# EAGLE design Grove I2C FM Receiver v1.1 (EAGLE 6.4)
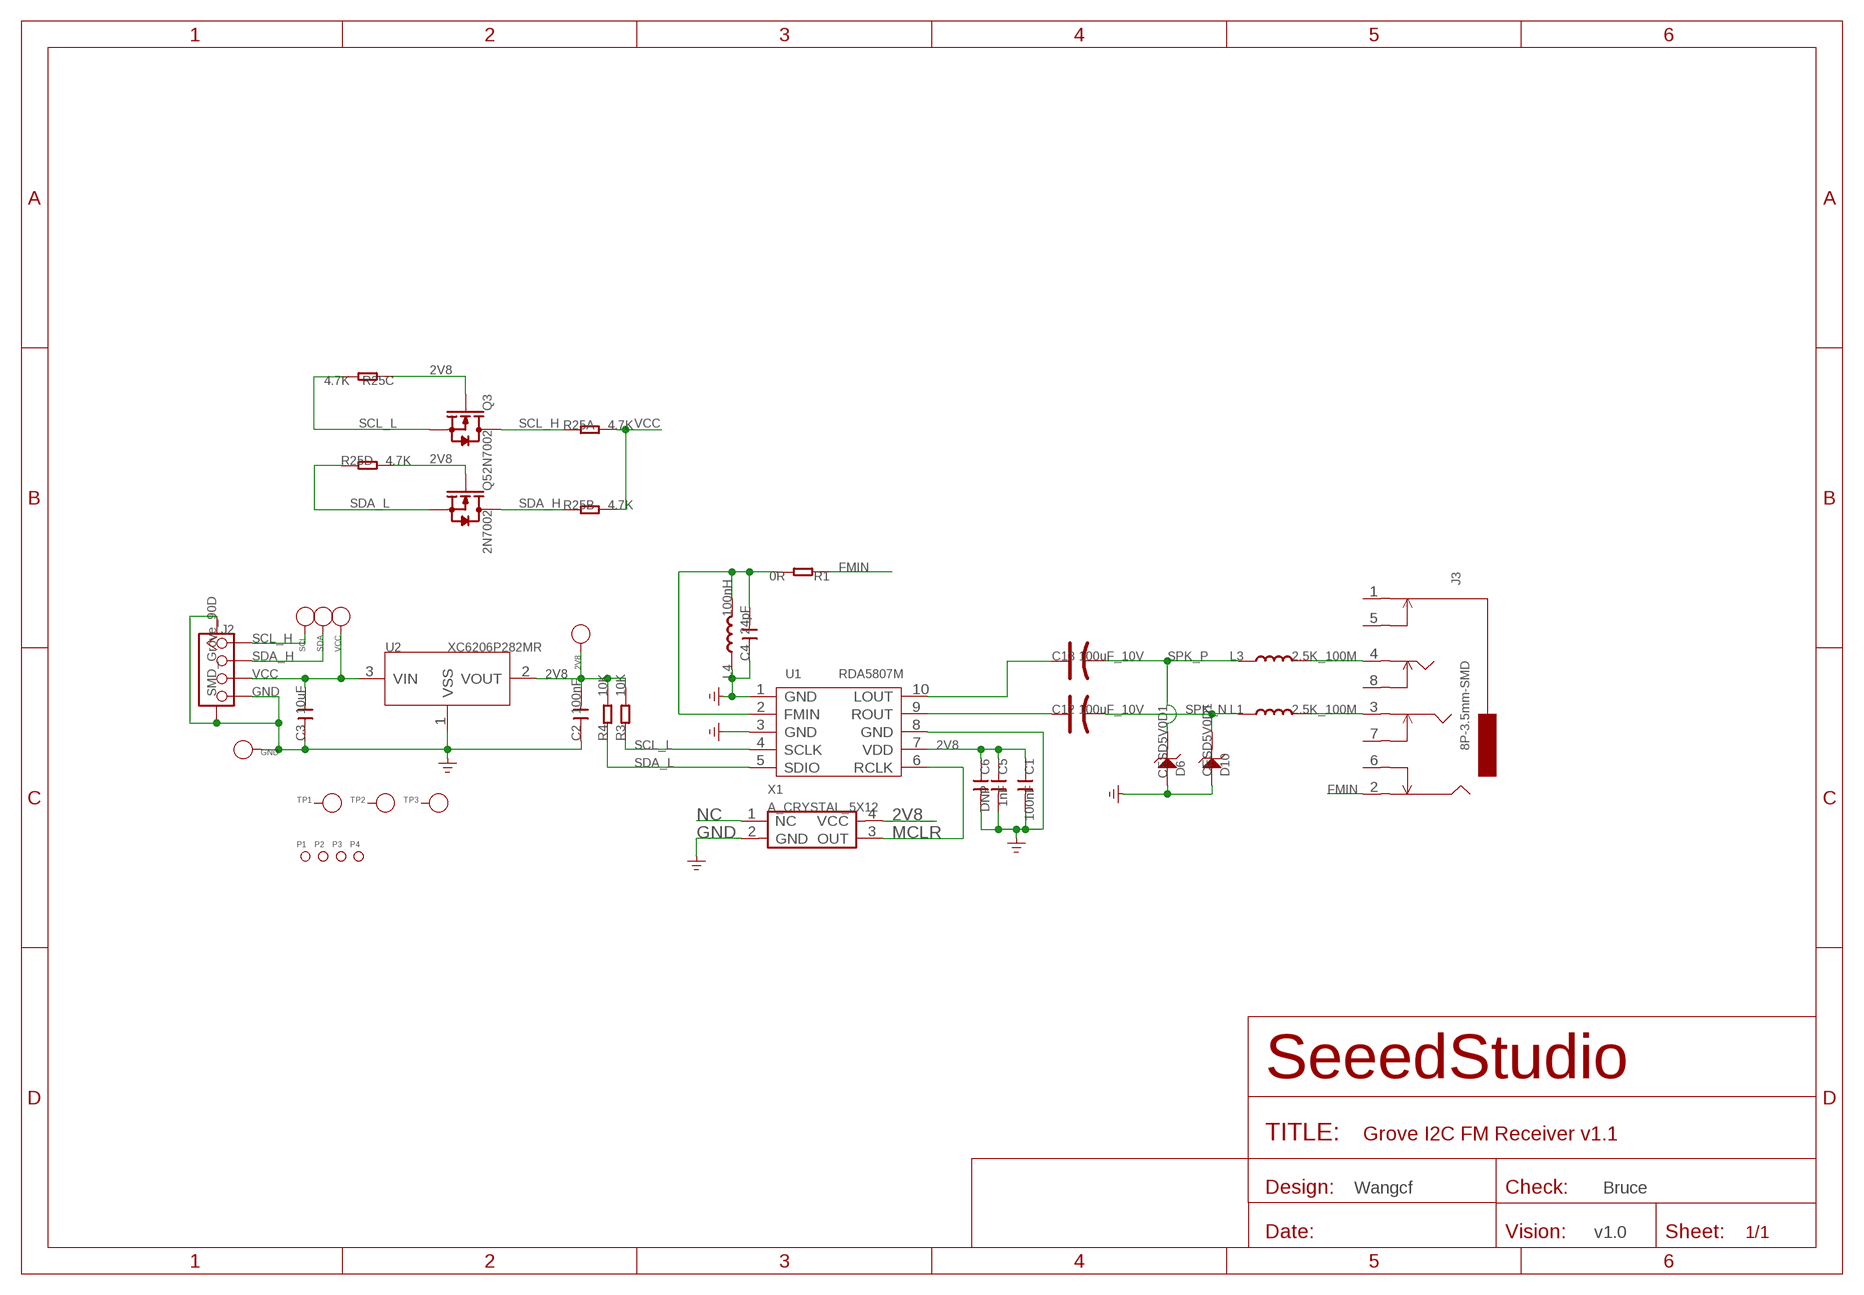
[diagram p0: schematic, sheet 1]

## Parts
2V8  PAD-TEST-POINT'4545'  [TP_4545]
C1  100nF  C-0603  [C0603]
C2  100nF  C-0603  [C0603]
C3  10uF  C-0805  [C0805]
C4  24pF  C-0603  [C0603]
C5  1nF  C-0603  [C0603]
C6  DNP  C-0603  [C0603]
C12  100uF_10V  CAP-AVX-B  [AVX-B]
C13  100uF_10V  CAP-AVX-B  [AVX-B]
D6  CESD5V0D1  D-ESD  [SOD123-2.7X1.6]
D10  CESD5V0D1  D-ESD  [SOD123-2.7X1.6]
GND  PAD-TEST-POINT'4545'  [TP_4545]
J2  SMD_Grove_90D  TWIG-4P-2.0-SMD-FEMALE-REINFORCE'DD'  [4P-SMD-2.0]
J3  8P-3.5mm-SMD  AUDIO-8P'PJ-3536-L6S'  [8P-3.5-SMD]
L1  2.5K_100M  L'0603'  [L0603]
L3  2.5K_100M  L'0603'  [L0603]
L4  100nH  L'0603'  [L0603]
P1  PAD-MARK'ANNULAR'  [ROUND-MARK-1.0]
P2  PAD-MARK'ANNULAR'  [ROUND-MARK-1.0]
P3  PAD-MARK'ANNULAR'  [ROUND-MARK-1.0]
P4  PAD-MARK'ANNULAR'  [ROUND-MARK-1.0]
Q3  2N7002  MOSFET-N'SOT23'  [SOT23]
Q5  2N7002  MOSFET-N'SOT23'  [SOT23]
R1  0R  R-0603  [R0603]
R3  10K  R-0603  [R0603]
R4  10K  R-0603  [R0603]
R25  4.7K  R-4R-1206  [1206-8-3.3X2.4]
SCL  PAD-TEST-POINT'4545'  [TP_4545]
SDA  PAD-TEST-POINT'4545'  [TP_4545]
TP1  PAD-TEST-POINT'4545'  [TP_4545]
TP2  PAD-TEST-POINT'4545'  [TP_4545]
TP3  PAD-TEST-POINT'4545'  [TP_4545]
U1  RDA5807M  [MSOP10]
U2  XC6206P282MR  XC6206MR  [SOT23]
VCC  PAD-TEST-POINT'4545'  [TP_4545]
X1  A_CRYSTAL_5X12  [4P_5X12]

## Nets
2V8: 2V8.T C1.1 C2.2 C5.1 C6.1 Q3.1(G) Q5.1(G) R3.2 R4.2 R25.3 R25.5 U1.7(VDD) U2.2(VOUT) X1.4(VCC)
FMIN: J3.2 R1.1
FMIN1: C4.2 L4.2 R1.2 U1.2(FMIN)
GND: C1.2 C2.1 C3.1 C4.1 C5.2 C6.2 D6.1 D10.1 GND.T J2.4 J2.SS1 J2.SS2 L4.1 U1.1(GND) U1.3(GND) U1.8(GND) U2.1(VSS) X1.2(GND)
MCLR: U1.6(RCLK) X1.3(OUT)
N$2: C12.+ U1.9(ROUT)
N$4: C13.+ U1.10(LOUT)
N$5: J3.4 L3.2
N$6: J3.3 L1.2
NC: X1.1(NC)
SCL_H: J2.1 Q3.3(D) R25.1 SCL.T
SCL_L: Q3.2(S) R3.1 R25.6 U1.4(SCLK)
SDA_H: J2.2 Q5.3(D) R25.2 SDA.T
SDA_L: Q5.2(S) R4.1 R25.4 U1.5(SDIO)
SPK_N: C12.- D10.2 L1.1
SPK_P: C13.- D6.2 L3.1
VCC: C3.2 J2.3 R25.7 R25.8 U2.3(VIN) VCC.T
Unconnected: J3.1 J3.5 J3.6 J3.7 J3.8 TP1.T TP2.T TP3.T

## Notes on the sheet
- Wangcf | Bruce
- v1.0

## Library data of the parts
2V8 GND SCL SDA TP1-TP3 VCC = Discrete:PAD-TEST-POINT; PARTNO: DNP
C1-C6 = Discrete:C*: Ceramic Capacitors
C12 C13 = Discrete:CAP*: Electrolytic Capacitors,Tantalum Capacitors and Super Capacitors
D6 D10 = template:D-ESD: Diodes for Protectiong against ESD
J2 = Connector :TWIG-4P-2.0-SMD-FEMALE-REINFORCE
J3 = template:AUDIO-8P
L1 L3 L4 = Discrete:L*
P1-P4 = Discrete:PAD-MARK; PARTNO: DNP
Q3 Q5 = Discrete:MOSFET-N: IRLL014: http://www.vishay.com/docs/91319/sihll014.pdf
R1 R3 R4 = Discrete:R*
R25 = Discrete:R-4R*: Resistor Array
U1 = template:RDA5807M: SINGLE-CHIP BROADCAST FM RADIO TUNER
U2 = IC:XC6206: LOW ESR Cap.Compatible Positive Voltage Regulators
X1 = CPT_SMD:A_CRYSTAL

## Net classes
0 default: width 0.152 mm, drill 0.305 mm, clearance 0.152 mm

## Board
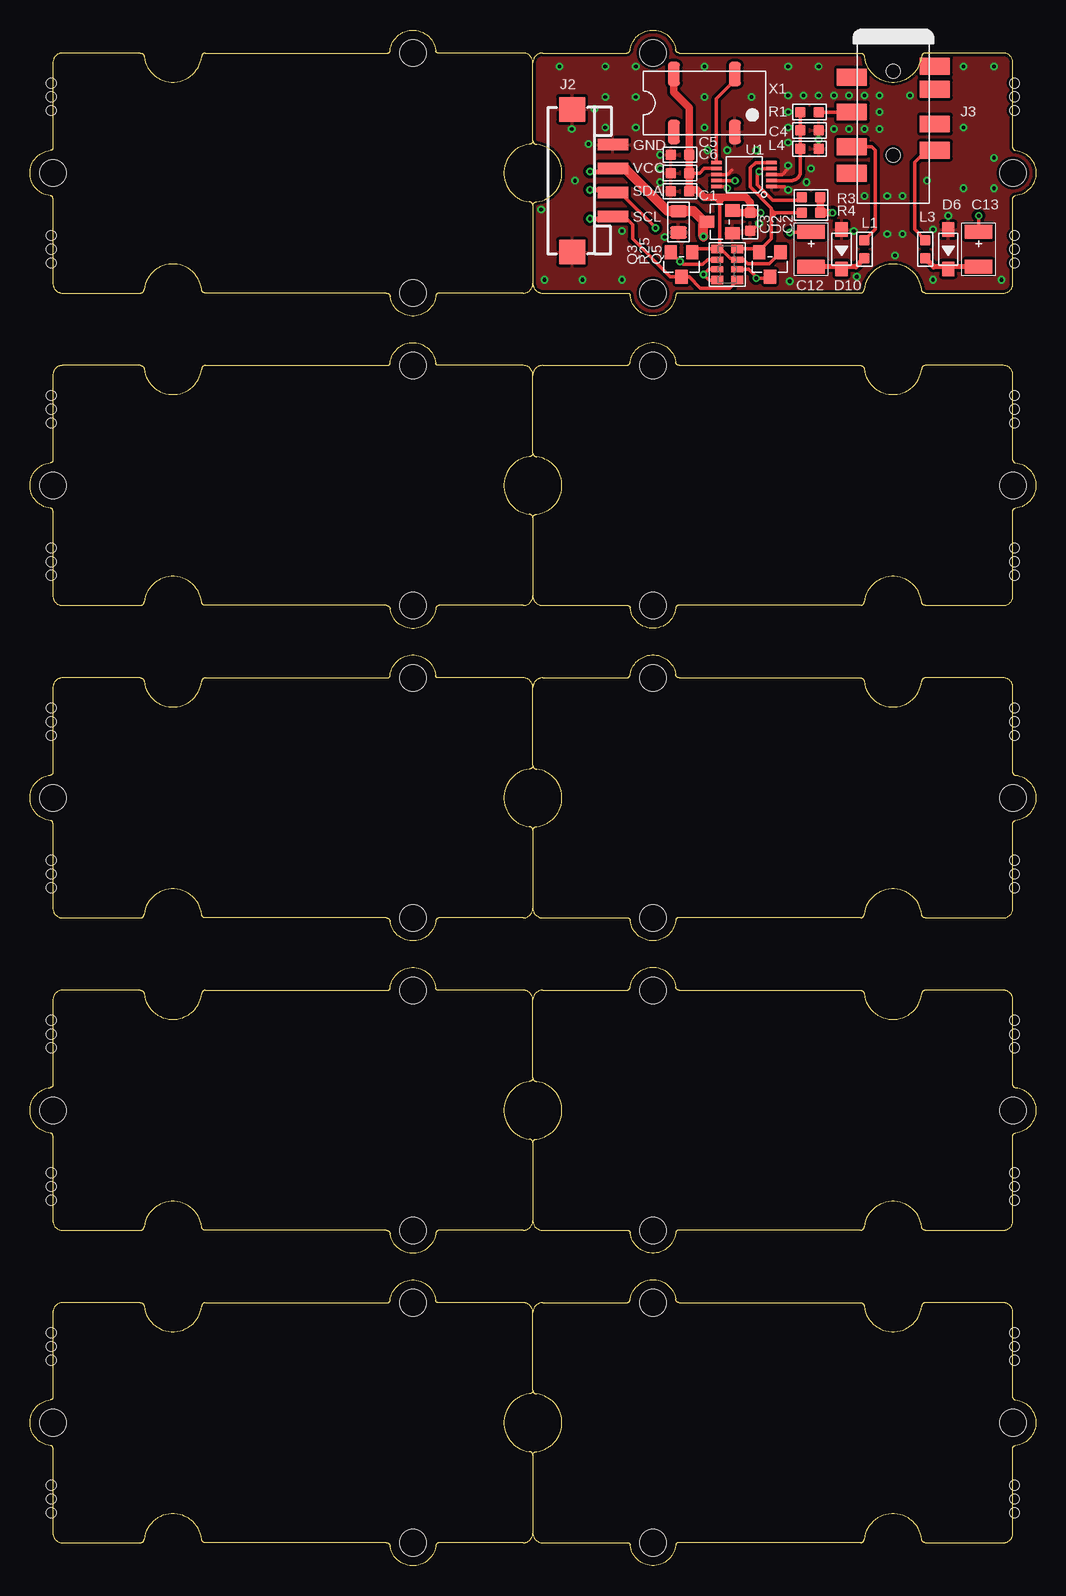
[diagram p1: board, top side]
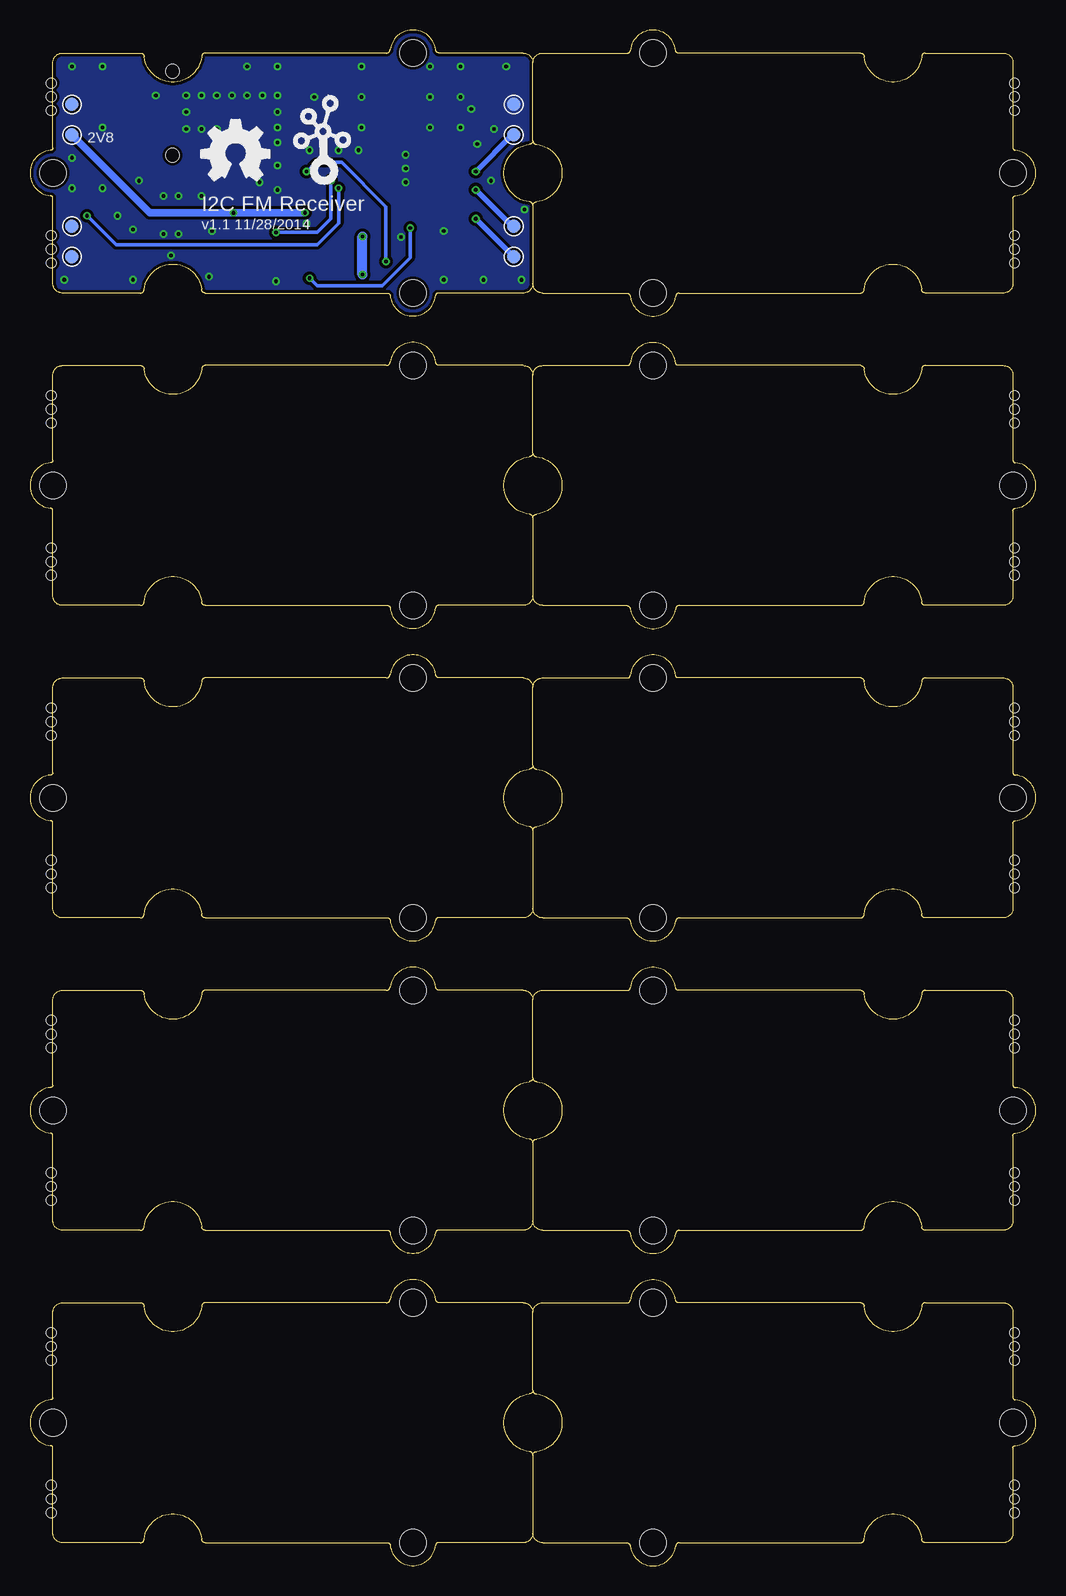
[diagram p2: board, bottom side, seen from below]

Size 83.82 x 127.98 mm. Coordinates in mm from the lower left corner, seen from the top.
Copper layers (1*16): Top 0.035mm / dielectric 1.5mm / Bottom 0.035mm
Design rules "SeeedStudio_DRU_no_angle_20130527 *": minimum track width 6mil, minimum drill 12mil, track to track 6mil, track to pad 6mil, pad to pad 6mil, via to via 6mil, smd to smd 0mil, copper to edge 10mil, drill to drill 10mil, minimum pad ring 10mil, minimum via ring 6mil, stop-mask expansion 2mil, vias tented up to drill 25mil, thermal gap 10mil
Holes 0.8 mm at 1.78,123.55 1.78,121.27 1.78,122.41 1.78,110.85 1.78,108.57 1.78,109.71 1.78,97.52 1.78,95.23 1.78,96.38 1.78,84.82 1.78,82.53 1.78,83.68 1.78,71.48 1.78,69.2 1.78,70.34 1.78,58.78 1.78,56.5 1.78,57.64 1.78,45.45 1.78,43.16 1.78,44.31 1.78,32.75 1.78,30.46 1.78,31.61 1.78,19.41 1.78,17.13 1.78,18.27 1.78,6.71 1.78,4.43 1.78,5.57 82.04,121.27 82.04,123.55 82.04,122.41 82.04,108.57 82.04,110.85 82.04,109.71 82.04,95.23 82.04,97.52 82.04,96.38 82.04,82.53 82.04,84.82 82.04,83.68 82.04,69.2 82.04,71.48 82.04,70.34 82.04,56.5 82.04,58.78 82.04,57.64 82.04,43.16 82.04,45.45 82.04,44.31 82.04,30.46 82.04,32.75 82.04,31.61 82.04,17.13 82.04,19.41 82.04,18.27 82.04,4.43 82.04,6.71 82.04,5.57
Holes 1.91 mm at -4.13,2.4 87.95,2.4 87.95,125.59 -4.13,125.59

### Footprints (pad centres in the part's own frame; a part is rotated, then mirrored left to right if it is on the bottom)
TP_4545 = smd 1.143 x 1.143: T 0,0
C0603 = smd 0.889 x 0.889: 1 -0.762,0; 2 0.762,0
C0805 = smd 1.016 x 1.397: 1 -0.889,0; 2 0.889,0
AVX-B = smd 1.143 x 2.286: + -1.46,0; - 1.46,0
SOD123-2.7X1.6 = smd 1.2 x 1.02: 1 -1.635,0; 2 1.635,0
4P-SMD-2.0 = smd 0.965 x 2.54: 1 -3,0; 2 -1,0; 3 1,0; 4 3,0 | smd 2.032 x 2.184: SS1 -5.946,3.4; SS2 5.946,3.4
8P-3.5-SMD = smd 1.4 x 2.5: 1 2.8,-3.45; 2 5.7,-3.45; 3 8.6,-3.45; 4 8.9,3.45; 5 1.9,3.45; 6 3.8,3.45; 7 6.7,3.45; 8 10.8,-3.45 | hole 1.149: 2.3,0; 9.3,0
L0603 = smd 0.889 x 0.889: 1 -0.762,0; 2 0.762,0
ROUND-MARK-1.0 = smd 1.016 x 1.016: P$1 0,0
SOT23 = smd 1.016 x 1.143: 1 -0.889,-1.016; 2 0.889,-1.016; 3 0,1.016
R0603 = smd 0.889 x 0.889: 1 -0.762,0; 2 0.762,0
1206-8-3.3X2.4 = smd 0.7 x 1: 1 -1.3,-0.85; 4 1.3,-0.85; 5 1.3,0.85; 8 -1.3,0.85 | smd 0.5 x 1: 2 -0.4,-0.85; 3 0.4,-0.85; 6 0.4,0.85; 7 -0.4,0.85
MSOP10 = smd 0.305 x 0.889: 1 -1,-2.3; 2 -0.5,-2.3; 3 0,-2.3; 4 0.5,-2.3; 5 1,-2.3; 6 1,2.3; 7 0.5,2.3; 8 0,2.3; 9 -0.5,2.3; 10 -1,2.3
SOT23' = smd 1.016 x 1.2: 1 -0.95,-1.06; 2 0.95,-1.06; 3 0,1.06
GROVE-TEST-PLATFORM = hole 2.2: -10,-10; -10,10; 20,0
4P_5X12 = smd 1.016 x 2.032: 1 -2.54,-2.413; 2 2.54,-2.413; 3 2.54,2.413; 4 -2.54,2.413

### Placement (x,y rotation side)
2V8  80.33,119.24 180 bottom
C1  54.17,114.54 180 top
C2  60.01,112 90 top
C3  54.04,112 90 top
C4  64.96,119.62 180 top
C5  54.17,117.59 180 top
C6  54.17,116.06 180 top
C12  65.09,109.71 270 top
C13  79.06,109.71 270 top
D6  76.52,109.71 270 top
D10  67.63,109.71 270 top
GND  43.5,121.78 180 bottom
J2  48.58,115.43 90 top
J3  71.95,126.86 270 top
L1  69.53,109.71 90 top
L3  74.61,109.71 90 top
L4  64.96,118.09 180 top
P1  -4.13,120.51 0 top  (outside the outline)
P2  -4.13,7.48 0 top  (outside the outline)
P3  87.95,120.51 0 top  (outside the outline)
P4  87.95,7.48 0 top  (outside the outline)
Q3  54.29,108.44 180 top
Q5  61.66,108.44 180 top
R1  64.96,121.14 180 top
R3  65.09,114.03 0 top
R4  65.09,112.76 0 top
R25  58.1,108.44 90 top
SCL  43.5,109.08 180 bottom
SDA  43.5,111.62 180 bottom
TP1  80.33,121.78 0 bottom
TP2  80.33,111.62 0 bottom
TP3  80.33,109.08 0 bottom
U1  59.5,115.93 90 top
U2  XC6206P282MR  [SOT23']  57.47,112 90 top
U$2  [GROVE-TEST-PLATFORM]  21.91,116.06 180 top
U$6  [GROVE-TEST-PLATFORM]  61.91,116.06 0 top
U$7  [OSHW_FILLX200_NOTEXT]  69.53,115.43 0 bottom
U$10  [GROVE-TEST-PLATFORM]  21.91,90.03 180 top
U$11  [TWIGLOGO]  59.37,116.06 0 bottom
U$12  [GROVE-TEST-PLATFORM]  61.91,90.03 0 top
U$13  [GROVE-TEST-PLATFORM]  21.91,63.99 180 top
U$14  [GROVE-TEST-PLATFORM]  61.91,63.99 0 top
U$15  [GROVE-TEST-PLATFORM]  21.91,37.96 180 top
U$16  [GROVE-TEST-PLATFORM]  61.91,37.96 0 top
U$17  [GROVE-TEST-PLATFORM]  21.91,11.92 180 top
U$18  [GROVE-TEST-PLATFORM]  61.91,11.92 0 top
VCC  43.5,119.24 180 bottom
X1  56.2,121.9 0 top

### Tracks (layer width: path | path; a pad name or v marks a point on that pad's centre or on a via)
2V8  (via drill 0.3 pad 0.61)
  Top 0.305: R25.5 57.57,109.74 58.36,108.95 58.85,108.95 R25.3 59.48,108.84 59.81,108.52 61.61,108.52 Q5.1 | C6.1 55.82,116.06 56.2,116.44 57.19,116.44 U1.7 | R25.5 55.47,109.74 Q3.1 | 57.47,113.52 57.47,109.96 R25.5 | 57.47,113.52 57.47,114.03 | 57.47,113.52 57.85,113.9 57.09,113.9 57.47,113.52
  Top 0.61: C1.1 54.93,114.66 | 54.93,114.66 C6.1 C5.1 54.93,121.52 53.66,122.79 X1.4 | C2.2 58.72,112.76 U2.2 | 54.93,114.66 55.56,114.66 56.2,114.03 57.47,114.03 59.63,114.03 60.01,113.65 C2.2 | v66.87,112.76 R4.2 R3.2 | v60.9,112.76 C2.2
  Bottom 0.61: v60.9,112.76 v66.87,112.76 73.85,112.76 2V8.T
FMIN
  Top 0.305: R1.1 68.48,121.14 J3.2
FMIN1
  Top 0.305: U1.2 63.45,115.43 arc90 64.2,116.19 L4.2 C4.2 | 64.2,119.87 C4.2 | C4.2 R1.2
GND  (via drill 0.3 pad 0.64)
  Top 0.305: U1.1 62.91,114.93 v63.18,114.66 | U1.3 62.68,115.93 63.18,116.44 v63.18,116.7 | C2.1 60.14,111.24 v60.77,111.87 | U1.8 58.1,115.93 58.48,116.32
  other vias: 71.44,114.16 72.71,114.16 70.8,121.14 70.8,119.74 80.33,114.79 52.9,110.73 52.52,115.3 68.64,111.24 71.44,110.98 72.71,110.98 58.1,117.97 66.99,122.54 65.72,122.54 64.45,122.54 63.18,122.54 63.18,121.14 63.18,119.87 63.18,118.6 65.72,118.86 65.09,116.44 64.71,115.3 70.8,122.54 68.26,122.54 69.53,122.54 66.99,119.74 68.26,119.74 69.53,119.74 47.94,124.95 50.48,124.95 50.48,122.41 47.94,122.41 46.04,107.17 49.34,107.17 63.31,107.04 75.25,111.36 47.94,119.87 50.48,119.87 80.33,124.95 77.79,124.95 63.18,124.95 65.72,124.95 52.52,117.59 60.52,117.97 56.2,124.95 77.79,119.87 77.79,114.79 52.52,116.44 69.53,114.16 74.74,115.43 44.13,124.95 45.4,115.43 42.86,107.17 72.07,109.2 75.25,107.17 68.9,107.43 76.52,112.51 56.45,117.97 56.2,119.87 56.2,122.41 60.14,122.41 80.96,107.17 73.34,122.54 45.15,119.74 46.55,118.47 47.05,121.4 49.34,111.24 42.61,113.01 80.33,117.33
  pour Bottom (isolate 0.254): 84.14,128.13 84.14,103.36 41.59,103.36 41.59,128.13
  pour Top (isolate 0.254): 84.14,128.13 84.14,103.36 41.59,103.36 41.59,128.13
MCLR
  Top 0.305: U1.6 57.2,122.27 58.74,123.81 X1.3
N$2  (via drill 0.3 pad 0.61)
  Top 0.305: U1.9 58.73,115.43 v58.74,115.43 | v63.31,111.11 65.02,111.11 C12.+
  Bottom 0.305: v58.74,115.43 58.74,112.25 59.88,111.11 v63.31,111.11
N$4  (via drill 0.3 pad 0.61)
  Top 0.305: U1.10 57.96,114.93 v58.1,114.79 | v79.06,112.51 C13.+
  Bottom 0.305: v58.1,114.79 58.1,111.89 59.9,110.09 76.65,110.09 v79.06,112.51
N$5
  Top 0.305: L3.2 73.72,111.36 73.72,116.95 74.74,117.97 75.39,117.97 J3.4
N$6
  Top 0.305: L1.2 70.42,111.36 70.42,117.97 70.13,118.26 J3.3
SCL_H  (via drill 0.3 pad 0.64)
  Top 0.305: 48.4,112.25 49.72,112.25 50.23,111.74 50.23,110.57 53.37,107.43 Q3.3 54.93,107.43 55.87,106.48 58.29,106.48 R25.1
  Top 0.406: v46.67,112.25 48.4,112.25 J2.1
  Bottom 0.406: SCL.T v46.67,112.25
SCL_L  (via drill 0.3 pad 0.61)
  Top 0.305: R25.6 56.47,108.84 56.07,108.44 54.42,108.44 v54.17,108.7 Q3.2 | U1.4 61.02,116.43 v60.77,116.19 60.61,116.02 60.61,115.08 61.91,113.78 64.07,113.78 R3.1
  Bottom 0.305: v54.17,108.7 54.17,113.27 57.85,116.95 60.01,116.95 v60.77,116.19
SDA_H  (via drill 0.3 pad 0.61, 0.3 pad 0.64)
  Top 0.305: J2.2 49.2,114.43 v52.13,111.49 | v60.52,107.3 60.64,107.3 | 60.64,107.3 61.53,107.3 Q5.3 | R25.2 59.9,108.04 60.64,107.3
  Top 0.406: v46.67,114.66 48.34,114.66 J2.2
  Bottom 0.305: v52.13,111.49 52.13,109 54.46,106.68 59.9,106.68 v60.52,107.3
  Bottom 0.406: SDA.T 43.63,111.62 v46.67,114.66
SDA_L
  Top 0.305: R25.4 60.49,109.74 Q5.2 60.77,109.58 61.79,110.6 61.79,112.38 | U1.5 60.46,116.93 60.02,116.5 60.02,114.9 61.79,113.14 61.79,113.01 | 61.79,113.01 61.79,112.76 | 61.79,112.76 61.79,112.38 | R4.1 62.17,112.76 | 62.04,112.76 61.79,112.76 | 61.79,112.38 62.17,112.76 | 62.17,112.76 62.04,112.76 | 62.04,112.76 61.79,113.01
SPK_N
  Top 0.406: L1.1 68.83,108.25 67.8,108.25 | 67.8,108.25 D10.2 | 67.8,108.25 C12.-
SPK_P
  Top 0.406: C13.- 76.69,108.25 | 76.69,108.25 D6.2 | 76.69,108.25 75.31,108.25 L3.1
VCC  (via drill 0.3 pad 0.61, 0.3 pad 0.64)
  Top 0.305: R25.7 56.56,108.04 v56.12,107.6 56.58,107.14 R25.8
  Top 0.406: v46.67,116.19 48.34,116.19 J2.3
  Top 0.813: U2.3 56.27,112 | 56.27,112 56.2,112 55.31,112.89 C3.2 53.15,112.89 49.61,116.43 J2.3 | v56.12,110.78 56.12,111.85 56.27,112
  Bottom 0.406: VCC.T 43.63,119.24 v46.67,116.19
  Bottom 0.813: v56.12,107.6 v56.12,110.78

### Text on the board
tPlace: GND | VCC | SDA | SCL
bPlace: I2C FM Receiver | v1.1 11/28/2014
bNames: 2V8